# Altium project EVK-NORA-B10x.PrjPcb (part 1 of 3)
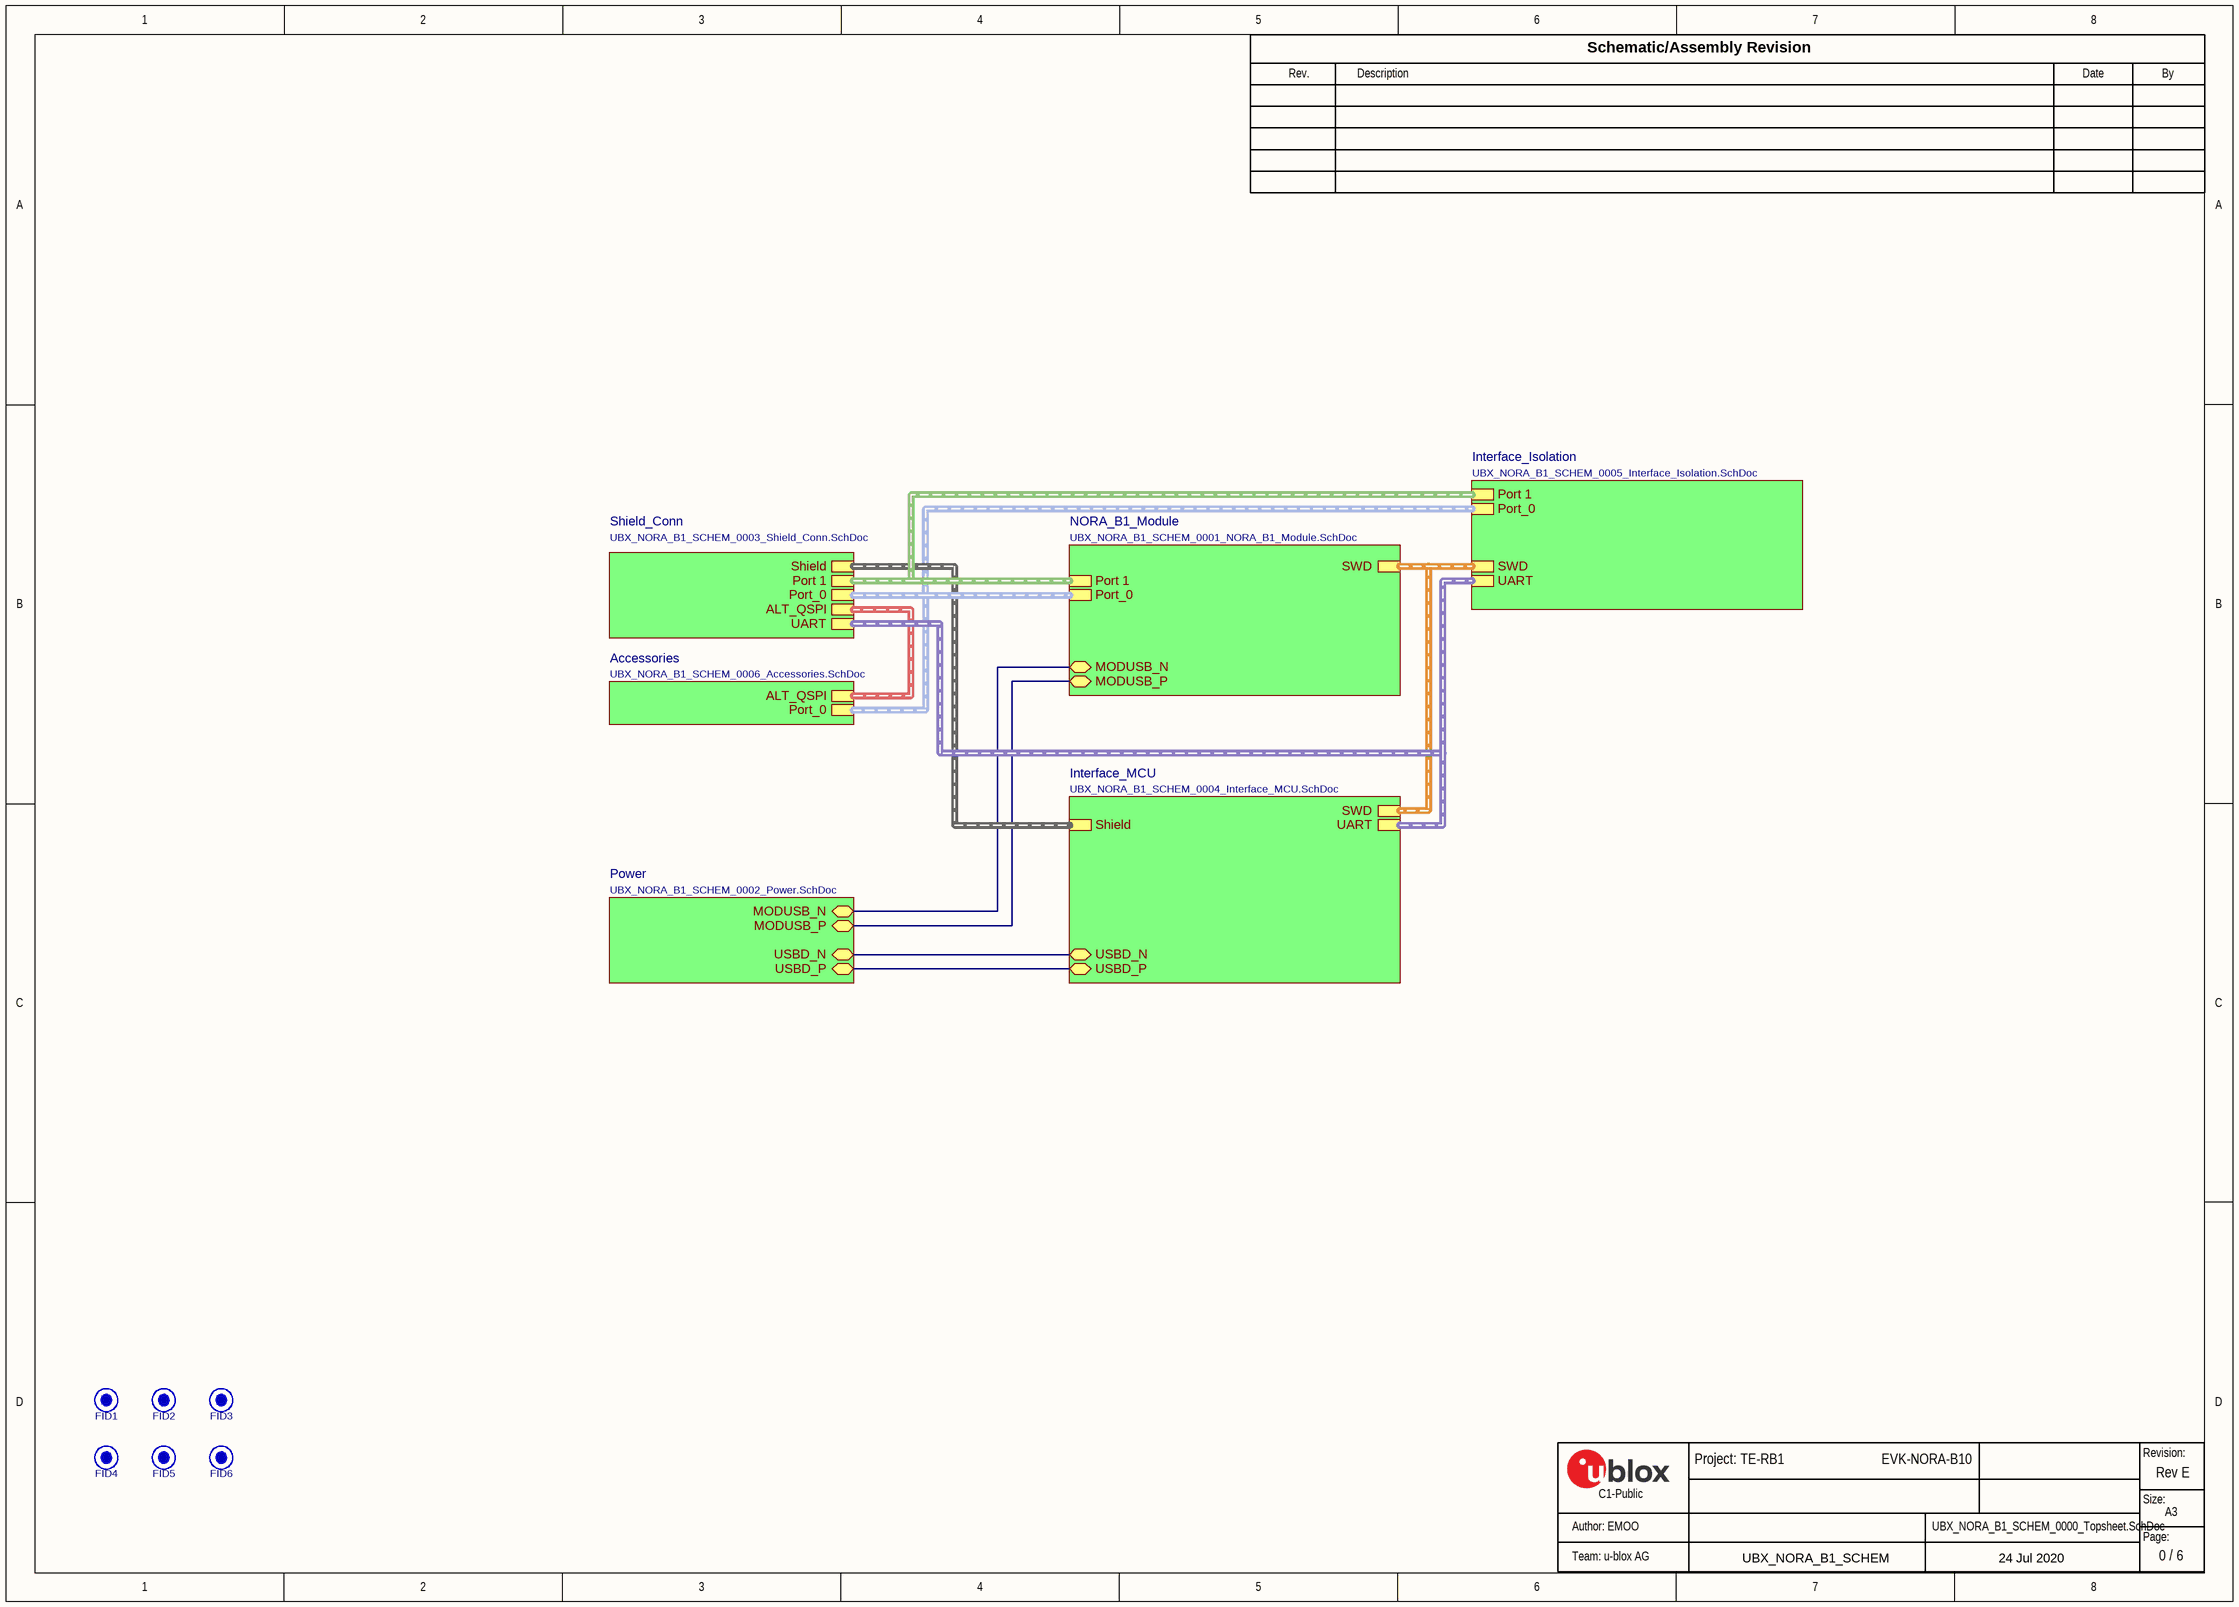
[diagram p0: UBX_NORA_B1_SCHEM_0000_Topsheet.SchDoc]
GlobalClientName: u-blox; GlobalProjectCode: EVK-NORA-B10; GlobalProjectLink: www.u-blox.com; GlobalProjectName: TE-RB1; GlobalProjectRevision: Rev E; GlobalProjectTeam: u-blox AG; GlobalReleaseDate: 4/28/2021; PCBDocNum: UBXH60-0000702; PCBName: EVK-NORA-B10; ProjectEngineer: EMOO; ReleaseBy1: EMOO; ReleaseBy2: EMOO; ReleaseBy3: EMOO; ReleaseBy4: EMOO; ReleaseBy5: EMOO; ReleaseDate1: 7/20/2020; ReleaseDate2: 9/16/2020; ReleaseDate3: 11/16/2020; ReleaseDate4: 3/16/2021; ReleaseDate5: 4/28/2021; ReleaseDesc1: Initial Prototype Release; ReleaseDesc2: Second Prototype Release; ReleaseDesc3: Engineering Sample Release; ReleaseDesc4: Initial Production Release; ReleaseDesc5: Addition of BGA-121 Interface IC; ReleaseRev1: Rev A; ReleaseRev2: Rev B; ReleaseRev3: Rev C; ReleaseRev4: Rev D; ReleaseRev5: Rev E; SchConfidentialGrade: C1-Public; SchDocNum: UBX_NORA_B1_SCHEM; SchSheetTotal: 6; VariantRev: Rev E
7 sheets, 362 parts. Net scope: flat (ports and power ports of the same name join across sheets).
Board file: NORA-B1-EVK.PcbDoc
Sheets:
  UBX_NORA_B1_SCHEM_0000_Topsheet.SchDoc
    NORA_B1_Module = UBX_NORA_B1_SCHEM_0001_NORA_B1_Module.SchDoc
    Interface_MCU = UBX_NORA_B1_SCHEM_0004_Interface_MCU.SchDoc
    Shield_Conn = UBX_NORA_B1_SCHEM_0003_Shield_Conn.SchDoc
    Interface_Isolation = UBX_NORA_B1_SCHEM_0005_Interface_Isolation.SchDoc
    Accessories = UBX_NORA_B1_SCHEM_0006_Accessories.SchDoc
    Power = UBX_NORA_B1_SCHEM_0002_Power.SchDoc

## Sheet UBX_NORA_B1_SCHEM_0000_Topsheet.SchDoc
size A3; Date: 7/24/2020; CompanyName: U-Blox; DrawnBy: EMOO; Engineer: EMOO; Organization: U-Blox; Address1: 3950 Fairview Industrial Dr SE #100; Address2: Salem, OR 97302; SheetNumber: 0; SheetTotal: 6; SheetSize: B; SheetTitle: TopSheet

### Parts
FID1  FID  [FIDUCIAL40]  (value not drawn)
FID2  FID  [FIDUCIAL40]  (value not drawn)
FID3  FID  [FIDUCIAL40]  (value not drawn)
FID4  FID  [FIDUCIAL40]  (value not drawn)
FID5  FID  [FIDUCIAL40]  (value not drawn)
FID6  FID  [FIDUCIAL40]  (value not drawn)

### Sub-sheets
Accessories = UBX_NORA_B1_SCHEM_0006_Accessories.SchDoc: Port_0 (harness Port 0), ALT_QSPI (harness ALT_QSPI)
Interface_Isolation = UBX_NORA_B1_SCHEM_0005_Interface_Isolation.SchDoc: Port_0 (harness Port 0), SWD (harness SWD), UART (harness UART), Port 1 (harness Port 1)
Interface_MCU = UBX_NORA_B1_SCHEM_0004_Interface_MCU.SchDoc: SWD (harness SWD), USBD_N (bidir), USBD_P (bidir), UART (harness UART), Shield (harness Shield)
NORA_B1_Module = UBX_NORA_B1_SCHEM_0001_NORA_B1_Module.SchDoc: Port_0 (harness Port 0), Port 1 (harness Port 1), SWD (harness SWD), MODUSB_N (bidir), MODUSB_P (bidir)
Power = UBX_NORA_B1_SCHEM_0002_Power.SchDoc: USBD_N (bidir), MODUSB_P (bidir), MODUSB_N (bidir), USBD_P (bidir)
Shield_Conn = UBX_NORA_B1_SCHEM_0003_Shield_Conn.SchDoc: Port 1 (harness Port 1), Port_0 (harness Port 0), Shield (harness Shield), UART (harness UART), ALT_QSPI (harness ALT_QSPI)

### Nets
(unnamed): sheet NORA_B1_Module/MODUSB_N, sheet Power/MODUSB_N
(unnamed): sheet NORA_B1_Module/MODUSB_P, sheet Power/MODUSB_P
(unnamed): sheet Interface_MCU/USBD_N, sheet Power/USBD_N
(unnamed): sheet Interface_MCU/USBD_P, sheet Power/USBD_P

### Buses and harness runs
harness sheet Accessories/ALT_QSPI = sheet Shield_Conn/ALT_QSPI
harness sheet Accessories/Port_0 = sheet Interface_Isolation/Port_0 = sheet NORA_B1_Module/Port_0 = sheet Shield_Conn/Port_0
harness sheet Interface_Isolation/Port 1 = sheet NORA_B1_Module/Port 1 = sheet Shield_Conn/Port 1
harness sheet Interface_Isolation/SWD = sheet Interface_MCU/SWD = sheet NORA_B1_Module/SWD
harness sheet Interface_Isolation/UART = sheet Interface_MCU/UART = sheet Shield_Conn/UART
harness sheet Interface_MCU/Shield = sheet Shield_Conn/Shield

### Notes on the sheet
- 24 Jul 2020
- Rev.
- Description
- Schematic/Assembly Revision
- Date
- By
- Revision:
- Page:
- Size:
- A3

### Library data of the parts
FID1-FID6 = UBXH00-0000100: FIDUCIAL MARK 1MM DIA; Editor: eric.moog; Env: ROHS; Permitted Use: Volume Products; Perferred: PREF; Part Number: UBXH00-0000100; Min Operating Temp: -55°C; Max Operating Temp: 155°C; Part Type: Testpoint; UBX Wiki: https://wiki.u-blox.com/bin/view/Operations/PartDetails?index=38802; RefDes: TP

## Sheet UBX_NORA_B1_SCHEM_0001_NORA_B1_Module.SchDoc: UBX_NORA_B1_SCHEM_0001_NORA_B1_Module
size A3; Date: 7/24/2020; CompanyName: U-blox; DrawnBy: EMOO; Engineer: EMOO; Organization: U-blox; Address1: 3950 Fairview Industrial Dr SE #100; Address2: Salem, OR 97302; SheetNumber: 1; SheetTotal: 6; Website: www.u-blox.com; SheetSize: B; SheetTitle: NORA_B1
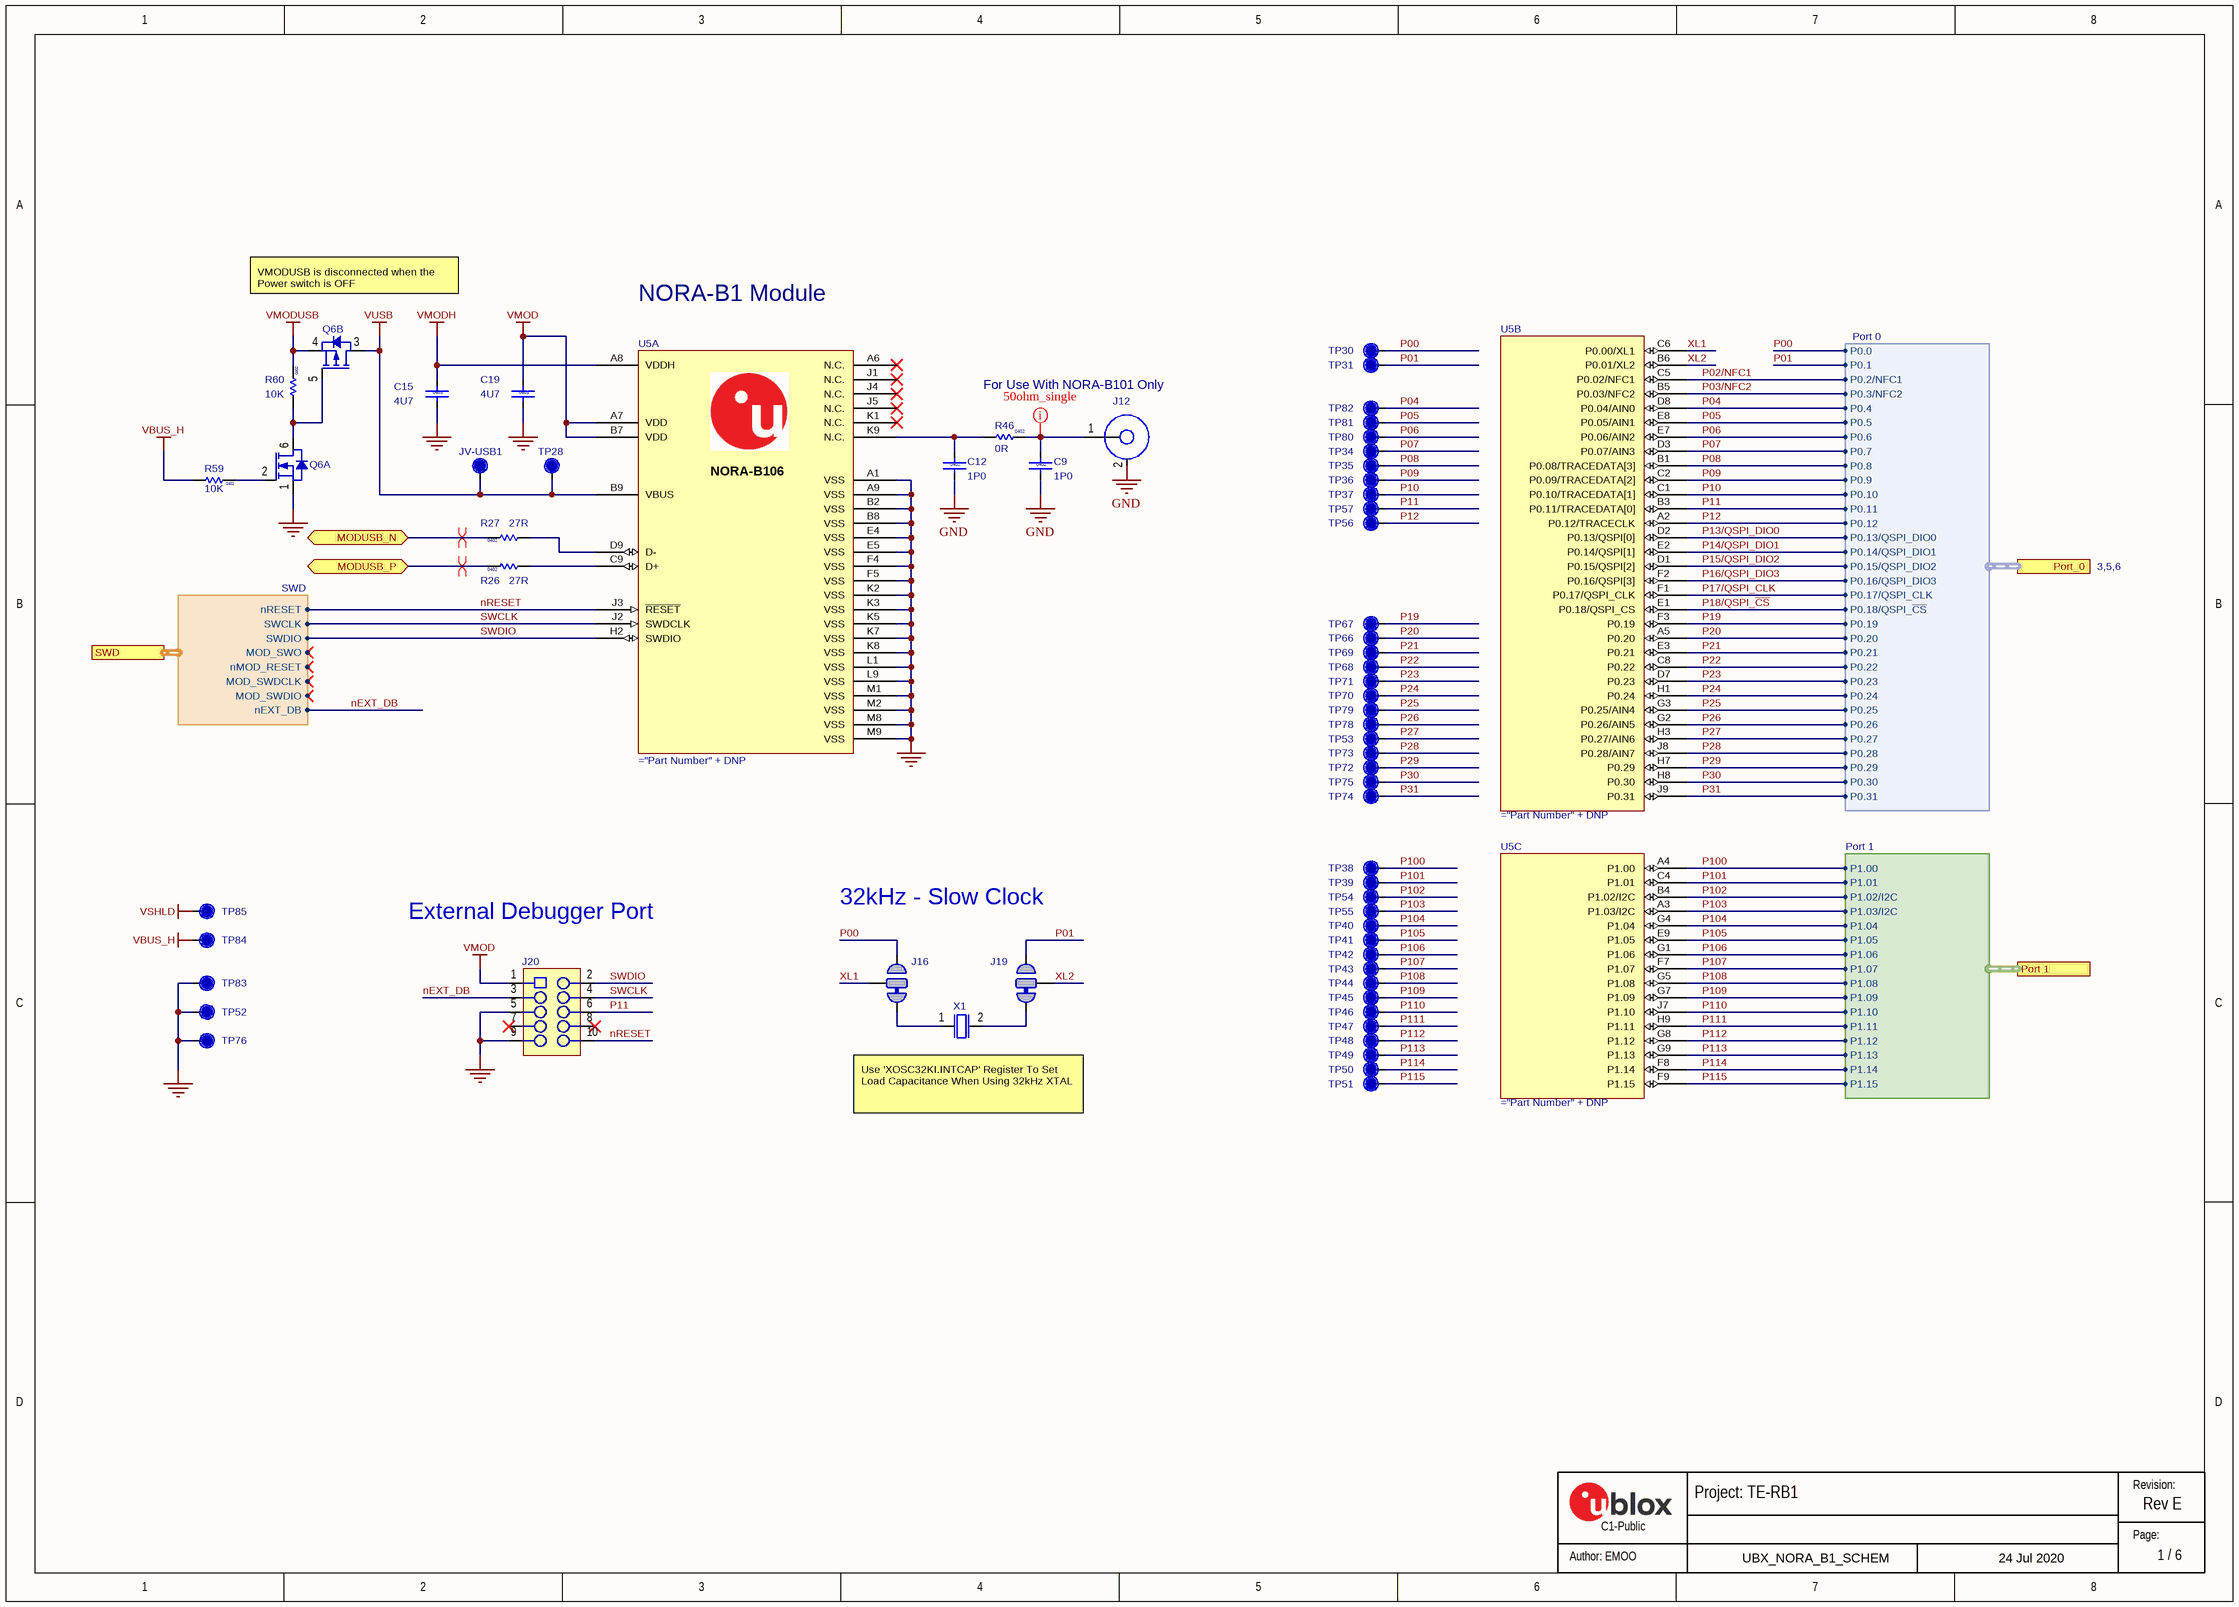
[diagram p1: UBX_NORA_B1_SCHEM_0001_NORA_B1_Module.SchDoc]

### Parts
C9  value 1P0  Size: 0402  [Cap 0402 HD]
C12  value 1P0  Size: 0402  [Cap 0402 HD]
C15  value 4U7  Size: 0603  [CAP 0603 HD]
C19  value 4U7  Size: 0603  [CAP 0603 HD]
J12  (no value)  [U.FL_3Pin]
J16  (no value)  [Solderbridge-Option]  (net tie, no BOM)
J19  (no value)  [Solderbridge-Option]  (net tie, no BOM)
J20  (no value)  [FTSH-105-01-F-DV-K]
JV-USB1  TP  [TP10R_NO_SILK]  (value not drawn)  (no BOM)
Q6  (no value)  [SOT-563]  (parts A,B of 2)
R26  value 27R  Size: 0402  [RES 0402 HD]
R27  value 27R  Size: 0402  [RES 0402 HD]
R46  value 0R  Size: 0402  [RES 0402 HD]
R59  value 10K  Size: 0402  [RES 0402 HD]
R60  value 10K  Size: 0402  [RES 0402 HD]
TP28  TP  [TP10R_NO_SILK]  (value not drawn)  (no BOM)
TP30  TP  [TP10R_NO_SILK]  (value not drawn)  (no BOM)
TP31  TP  [TP10R_NO_SILK]  (value not drawn)  (no BOM)
TP34  TP  [TP10R_NO_SILK]  (value not drawn)  (no BOM)
TP35  TP  [TP10R_NO_SILK]  (value not drawn)  (no BOM)
TP36  TP  [TP10R_NO_SILK]  (value not drawn)  (no BOM)
TP37  TP  [TP10R_NO_SILK]  (value not drawn)  (no BOM)
TP38  TP  [TP10R_NO_SILK]  (value not drawn)
TP39  TP  [TP10R_NO_SILK]  (value not drawn)
TP40  TP  [TP10R_NO_SILK]  (value not drawn)
TP41  TP  [TP10R_NO_SILK]  (value not drawn)
TP42  TP  [TP10R_NO_SILK]  (value not drawn)
TP43  TP  [TP10R_NO_SILK]  (value not drawn)
TP44  TP  [TP10R_NO_SILK]  (value not drawn)
TP45  TP  [TP10R_NO_SILK]  (value not drawn)
TP46  TP  [TP10R_NO_SILK]  (value not drawn)
TP47  TP  [TP10R_NO_SILK]  (value not drawn)
TP48  TP  [TP10R_NO_SILK]  (value not drawn)
TP49  TP  [TP10R_NO_SILK]  (value not drawn)
TP50  TP  [TP10R_NO_SILK]  (value not drawn)
TP51  TP  [TP10R_NO_SILK]  (value not drawn)
TP52  TP  [TP10R_NO_SILK]  (value not drawn)  (no BOM)
TP53  TP  [TP10R_NO_SILK]  (value not drawn)
TP54  TP  [TP10R_NO_SILK]  (value not drawn)
TP55  TP  [TP10R_NO_SILK]  (value not drawn)
TP56  TP  [TP10R_NO_SILK]  (value not drawn)  (no BOM)
TP57  TP  [TP10R_NO_SILK]  (value not drawn)  (no BOM)
TP66  TP  [TP10R_NO_SILK]  (value not drawn)
TP67  TP  [TP10R_NO_SILK]  (value not drawn)
TP68  TP  [TP10R_NO_SILK]  (value not drawn)
TP69  TP  [TP10R_NO_SILK]  (value not drawn)
TP70  TP  [TP10R_NO_SILK]  (value not drawn)
TP71  TP  [TP10R_NO_SILK]  (value not drawn)
TP72  TP  [TP10R_NO_SILK]  (value not drawn)
TP73  TP  [TP10R_NO_SILK]  (value not drawn)
TP74  TP  [TP10R_NO_SILK]  (value not drawn)
TP75  TP  [TP10R_NO_SILK]  (value not drawn)
TP76  TP  [TP10R_NO_SILK]  (value not drawn)  (no BOM)
TP78  TP  [TP10R_NO_SILK]  (value not drawn)
TP79  TP  [TP10R_NO_SILK]  (value not drawn)
TP80  TP  [TP10R_NO_SILK]  (value not drawn)  (no BOM)
TP81  TP  [TP10R_NO_SILK]  (value not drawn)  (no BOM)
TP82  TP  [TP10R_NO_SILK]  (value not drawn)  (no BOM)
TP83  TP  [TP10R_NO_SILK]  (value not drawn)  (no BOM)
TP84  TP  [TP10R_NO_SILK]  (value not drawn)  (no BOM)
TP85  TP  [TP10R_NO_SILK]  (value not drawn)  (no BOM)
U5  (no value)  [NORA-B106]  (parts A,B,C of 3)
X1  (no value)  [XTAL_3215]

### Ports
MODUSB_N (bidir), MODUSB_P (bidir), Port 1 (harness Port 1), Port_0 (harness Port 0), SWD (harness SWD)

### Harnesses
Port 0: P0.4, P0.5, P0.6, P0.7, P0.8, P0.9, P0.10, P0.11, P0.12, P0.19, P0.20, P0.21, P0.22, P0.23, P0.24, P0.25, P0.26, P0.27, P0.28, P0.29, P0.30, P0.31, P0.3/NFC2, P0.2/NFC1, P0.13/QSPI_DIO0, P0.14/QSPI_DIO1, P0.15/QSPI_DIO2, P0.16/QSPI_DIO3, P0.18/QSPI_~{CS}, P0.17/QSPI_CLK, P0.0, P0.1
Port 1: P1.00, P1.01, P1.02/I2C, P1.03/I2C, P1.04, P1.05, P1.06, P1.07, P1.08, P1.09, P1.10, P1.11, P1.12, P1.13, P1.14, P1.15
SWD: MOD_SWDIO, MOD_SWDCLK, SWCLK, SWDIO, nMOD_RESET, MOD_SWO, nRESET, nEXT_DB

### Nets
GND: C9.2 C12.2 C15.2 C19.2 J12.2 J20.5 J20.9 Q6.1(S1) TP52.1 TP76.1 TP83.1 U5.A1(VSS) U5.A9(VSS) U5.B2(VSS) U5.B8(VSS) U5.E4(VSS) U5.E5(VSS) U5.F4(VSS) U5.F5(VSS) U5.K2(VSS) U5.K3(VSS) U5.K5(VSS) U5.K7(VSS) U5.K8(VSS) U5.L1(VSS) U5.L9(VSS) U5.M1(VSS) U5.M2(VSS) U5.M8(VSS) U5.M9(VSS)
VBUS_H: R59.1 TP84.1
VMOD: C19.1 J20.1 U5.A7(VDD) U5.B7(VDD)
VMODH: C15.1 U5.A8(VDDH)
VMODUSB: Q6.4(S2) R60.2
VSHLD: TP85.1
VUSB: JV-USB1.1 Q6.3(D2) TP28.1 U5.B9(VBUS)
MODUSBD_N: R27.2 ; port MODUSB_N
MODUSBD_P: R26.2 ; port MODUSB_P
nEXT_DB: J20.3 ; port SWD.nEXT_DB
nRESET: J20.10 U5.J3(~{RESET}) ; port SWD.nRESET
P00: J16.3 TP30.1 ; port Port_0.P0.0
P01: J19.3 TP31.1 ; port Port_0.P0.1
P02/NFC1: U5.C5(P0.02/NFC1) ; port Port_0.P0.2/NFC1  [project net P0.2/NFC1]
P03/NFC2: U5.B5(P0.03/NFC2) ; port Port_0.P0.3/NFC2  [project net P0.3/NFC2]
P04: TP82.1 U5.D8(P0.04/AIN0) ; port Port_0.P0.4
P05: TP81.1 U5.E8(P0.05/AIN1) ; port Port_0.P0.5
P06: TP80.1 U5.E7(P0.06/AIN2) ; port Port_0.P0.6
P07: TP34.1 U5.D3(P0.07/AIN3) ; port Port_0.P0.7
P08: TP35.1 U5.B1(P0.08/TRACEDATA[3]) ; port Port_0.P0.8
P09: TP36.1 U5.C2(P0.09/TRACEDATA[2]) ; port Port_0.P0.9
P10: TP37.1 U5.C1(P0.10/TRACEDATA[1]) ; port Port_0.P0.10
P11: J20.6 TP57.1 U5.B3(P0.11/TRACEDATA[0]) ; port Port_0.P0.11  [project net P0.11]
P12: TP56.1 U5.A2(P0.12/TRACECLK) ; port Port_0.P0.12
P13/QSPI_DIO0: U5.D2(P0.13/QSPI[0]) ; port Port_0.P0.13/QSPI_DIO0
P14/QSPI_DIO1: U5.E2(P0.14/QSPI[1]) ; port Port_0.P0.14/QSPI_DIO1
P15/QSPI_DIO2: U5.D1(P0.15/QSPI[2]) ; port Port_0.P0.15/QSPI_DIO2
P16/QSPI_DIO3: U5.F2(P0.16/QSPI[3]) ; port Port_0.P0.16/QSPI_DIO3
P17/QSPI_CLK: U5.F1(P0.17/QSPI_CLK) ; port Port_0.P0.17/QSPI_CLK
P18/QSPI_~{CS}: U5.E1(P0.18/QSPI_CS) ; port Port_0.P0.18/QSPI_~{CS}
P19: TP67.1 U5.F3(P0.19) ; port Port_0.P0.19
P20: TP66.1 U5.A5(P0.20) ; port Port_0.P0.20
P21: TP69.1 U5.E3(P0.21) ; port Port_0.P0.21
P22: TP68.1 U5.C8(P0.22) ; port Port_0.P0.22
P23: TP71.1 U5.D7(P0.23) ; port Port_0.P0.23
P24: TP70.1 U5.H1(P0.24) ; port Port_0.P0.24
P25: TP79.1 U5.G3(P0.25/AIN4) ; port Port_0.P0.25
P26: TP78.1 U5.G2(P0.26/AIN5) ; port Port_0.P0.26
P27: TP53.1 U5.H3(P0.27/AIN6) ; port Port_0.P0.27
P28: TP73.1 U5.J8(P0.28/AIN7) ; port Port_0.P0.28
P29: TP72.1 U5.H7(P0.29) ; port Port_0.P0.29
P30: TP75.1 U5.H8(P0.30) ; port Port_0.P0.30
P31: TP74.1 U5.J9(P0.31) ; port Port_0.P0.31
P100: TP38.1 U5.A4(P1.00) ; port Port 1.P1.00
P101: TP39.1 U5.C4(P1.01) ; port Port 1.P1.01
P102: TP54.1 U5.B4(P1.02/I2C) ; port Port 1.P1.02/I2C
P103: TP55.1 U5.A3(P1.03/I2C) ; port Port 1.P1.03/I2C
P104: TP40.1 U5.G4(P1.04) ; port Port 1.P1.04
P105: TP41.1 U5.E9(P1.05) ; port Port 1.P1.05
P106: TP42.1 U5.G1(P1.06) ; port Port 1.P1.06
P107: TP43.1 U5.F7(P1.07) ; port Port 1.P1.07
P108: TP44.1 U5.G5(P1.08) ; port Port 1.P1.08
P109: TP45.1 U5.G7(P1.09) ; port Port 1.P1.09
P110: TP46.1 U5.J7(P1.10) ; port Port 1.P1.10
P111: TP47.1 U5.H9(P1.11) ; port Port 1.P1.11
P112: TP48.1 U5.G8(P1.12) ; port Port 1.P1.12
P113: TP49.1 U5.G9(P1.13) ; port Port 1.P1.13
P114: TP50.1 U5.F8(P1.14) ; port Port 1.P1.14
P115: TP51.1 U5.F9(P1.15) ; port Port 1.P1.15
SWCLK: J20.4 U5.J2(SWDCLK) ; port SWD.SWCLK
SWDIO: J20.2 U5.H2(SWDIO) ; port SWD.SWDIO
XL1: J16.2 U5.C6(P0.00/XL1)
XL2: J19.2 U5.B6(P0.01/XL2)
NetC9_1: C9.1 J12.1(ANT) R46.2
NetC12_1: C12.1 R46.1 U5.K9(N.C.)
NetJ16_1: J16.1 X1.1
NetJ19_1: J19.1 X1.2
NetQ6_2: Q6.2(G1) R59.2
NetQ6_5: Q6.5(G2) Q6.6(D1) R60.1
NetR26_1: R26.1 U5.C9(D+)
NetR27_1: R27.1 U5.D9(D-)

Not connected (* = marked no-connect by the designer): J20 7* 8*; U5 A6(N.C.)* J1(N.C.)* J4(N.C.)* J5(N.C.)* K1(N.C.)*

### Layout directives
differential pair; net class USB_DIFF: MODUSBD_N, MODUSBD_P
net class 50_ohm_se: NetC9_1

### Notes on the sheet
- VMODUSB is disconnected when the Power switch is OFF
- NORA-B1 Module
- For Use With NORA-B101 Only
- 32kHz - Slow Clock
- External Debugger Port
- (near X1) Use 'XOSC32KI.INTCAP' Register To Set Load Capacitance When Using 32kHz XTAL
- 24 Jul 2020
- Revision:
- Page:

### Library data of the parts
C9 C12 = UBXH01-0009002: CAP CER C0G 0402 1P0 +/-0.1P 50V; Manufacturer: Murata Manufacturing Company, Ltd.; Manufacturer P/N: GRM1555C1H1R0BA01; Editor: massimo.vlacci; Released by: sandro.sestan; Env: ROHS; Permitted Use: Volume Products; Perferred: PREF; Mfg P/N Status: NRND; Mfg P/N Split: 100; Mfg P/N Released: Yes; Part Number: UBXH01-0009002; Tolerance: +/-0.1P; Max Voltage: 50V; Min Operating Temp: -55°C; Max Operating Temp: 125°C; Part Type: Capacitor; Release Data: 2010-02-19T10:36:53; UBX Wiki: https://wiki.u-blox.com/bin/view/Operations/PartDetails?index=5431; RefDes: C; Manufacturer 2: Murata Manufacturing Company, Ltd.; Manufacturer P/N 2: GRM1555C1H1R0BZ01; Mfg P/N Status 2: Obsolete; Mfg P/N Split 2: 0; Mfg P/N Released 2: No
C15 C19 = UBXH01-2002003: CAP CER X5R 0603 4U7 10% 6.3V; Manufacturer: Murata Manufacturing Company, Ltd.; Manufacturer P/N: GRM188R61C475KE11; Editor: philippe.largier; Released by: roland.rust; Env: GREEN; Permitted Use: Volume Products; Perferred: PREF; Mfg P/N Status: Active; Mfg P/N Split: 100; Mfg P/N Released: Yes; Part Number: UBXH01-2002003; Tolerance: 10%; Max Voltage: 6.3V; Part Type: Capacitor; Release Data: 2016-02-02T16:39:45; UBX Wiki: https://wiki.u-blox.com/bin/view/Operations/PartDetails?index=5742; RefDes: C; Mfg P/N Datasheet: https://wiki.u-blox.com/bin/view/Generic/Docs/DocumentSummary?index=30154; Manufacturer 2: Murata Manufacturing Company, Ltd.; Manufacturer P/N 2: GRM188R61E475KE11; Mfg P/N Status 2: Active; Mfg P/N Split 2: 0; Mfg P/N Released 2: Yes; Mfg P/N Datasheet 2: https://wiki.u-blox.com/bin/view/Generic/Docs/DocumentSummary?index=30500; Manufacturer 3: Samsung Electro-Mechanics; Manufacturer P/N 3: CL10A475KO8NNN; Mfg P/N Status 3: NRND; Mfg P/N Split 3: 0; Mfg P/N Released 3: Yes; Mfg P/N Datasheet 3: https://wiki.u-blox.com/bin/view/Generic/Docs/DocumentSummary?index=28177
J12 = UBXH04-0000657: CONN U.FL STRAIGHT RECEPTACLE; Manufacturer P/N: U.FL-R-SMT-1(80); Manufacturer: Hirose; Value: U.FL-R-SMT-1(80); Editor: cam.nichols; Released by: eric.moog; Env: GREEN; Permitted Use: Volume Products; Perferred: PREF; Mfg P/N Status: Active; Mfg P/N Split: 100; Mfg P/N Released: No; Part Number: UBXH04-0000657; Min Operating Temp: -40°C; Max Operating Temp: 105°C; Part Type: Connector; Release Data: 2020-09-04T22:33:09; UBX Wiki: https://wiki.u-blox.com/bin/view/Operations/PartDetails?index=33335; RefDes: J; Mfg P/N Datasheet: https://wiki.u-blox.com/bin/view/Generic/Docs/DocumentSummary?index=32065; Manufacturer 2: Toptek; Manufacturer P/N 2: AB02001-126; Mfg P/N Status 2: Active; Mfg P/N Split 2: 0; Mfg P/N Released 2: No; Mfg P/N Datasheet 2: https://wiki.u-blox.com/bin/view/Generic/Docs/DocumentSummary?index=33337
J16 J19 = UBXH00-0000083: SOLDERBRIDGE-OPTION; Editor: aneeb.sohail; Env: GREEN; Permitted Use: Volume Products; Perferred: PREF; Part Number: UBXH00-0000083; Min Operating Temp: -55°C; Max Operating Temp: 155°C; Part Type: Connector; UBX Wiki: https://wiki.u-blox.com/bin/view/Operations/PartDetails?index=36362; RefDes: J
J20 = UBXH04-0000194: 2-ROW SMD-PCB CONN 50MIL GRID 10 -PIN 0.41MM SQUARE 4.0MM KEYED; Manufacturer P/N: FTSH-105-01-L-DV-K; Manufacturer: Samtec; Value: FTSH-105-01-L-DV-K; Editor: par.hakansson; Released by: adam.johansson; Env: ROHS; Permitted Use: Volume Products; Perferred: PREF; Mfg P/N Status: Active; Mfg P/N Split: 100; Mfg P/N Released: Yes; Part Number: UBXH04-0000194; Min Operating Temp: -40°C; Max Operating Temp: 85°C; Part Type: Connector; Release Data: 2015-11-06T11:35:39; UBX Wiki: https://wiki.u-blox.com/bin/view/Operations/PartDetails?index=20823; RefDes: J; Mfg P/N Datasheet: https://wiki.u-blox.com/bin/view/Generic/Docs/DocumentSummary?index=20824
JV-USB1 TP28 TP30 TP31 TP34-TP57 TP66-TP76 TP78-TP85 = UBXH00-0000096: TESTPOINT 1MM CIRCULAR NO SILKSCREEN; Editor: eric.moog; Permitted Use: Volume Products; Perferred: PREF; Part Number: UBXH00-0000096; Min Operating Temp: -55°C; Max Operating Temp: 125°C; Part Type: Testpoint; UBX Wiki: https://wiki.u-blox.com/bin/view/Operations/PartDetails?index=38784; Env: N/A; RefDes: TP
Q6 = UBXH20-0000084: SMALL SIGNAL COMPLEMENTARY W/ ESD PROTECTION MOSFET SOT-563-6 PACKAGE; Manufacturer: ON Semiconductor; Value: NTZD3155CT1G; Editor: pierpaolo.arban; Released by: matej.budin; Env: ROHS; Permitted Use: Support Products; Perferred: PREF; Mfg P/N Status: Active; Mfg P/N Split: 100; Mfg P/N Released: Yes; Part Number: UBXH20-0000084; Min Operating Temp: -55°C; Max Operating Temp: 155°C; Part Type: Transistor; Release Data: 2023-01-26T11:59:16; UBX Wiki: https://wiki.u-blox.com/bin/view/Operations/PartDetails?index=37717; RefDes: Q; Manufacturer P/N: NTZD3155CT1G; Mfg P/N Datasheet: https://wiki.u-blox.com/bin/view/Generic/Docs/DocumentSummary?index=9037
R26 R27 = UBXH18-0008011: RES THICK FILM CHIP 0402 27R 5% 100mW; Manufacturer: KOA; Manufacturer P/N: RK73B1ETTD270J; Editor: roland.rust; Env: ROHS; Permitted Use: Volume Products; Perferred: PREF; Mfg P/N Status: NRND; Mfg P/N Split: 100; Mfg P/N Released: Yes; Part Number: UBXH18-0008011; Tolerance: 5%; Max Power: 100mW; Part Type: Resistor; Released by: roland.rust; Release Data: 2005-07-22T13:59:44; UBX Wiki: https://wiki.u-blox.com/bin/view/Operations/PartDetails?index=6883; RefDes: R; Manufacturer 2: YAGEO; Manufacturer P/N 2: 2322_705_70279_L; Mfg P/N Status 2: Obsolete; Mfg P/N Split 2: 0; Mfg P/N Released 2: Yes
R46 = UBXH18-0003002: RES THICK FILM CHIP 0402 0R 0 100mW; Manufacturer: KOA; Manufacturer P/N: RK73Z1ETTD; Tolerance: 0; Editor: charlotte.biber; Released by: peter.mueller; Env: ROHS; Permitted Use: Volume Products; Perferred: PREF; Mfg P/N Status: NRND; Mfg P/N Split: 100; Mfg P/N Released: Yes; Part Number: UBXH18-0003002; Max Power: 100mW; Part Type: Resistor; Release Data: 2012-06-05T09:49:55; UBX Wiki: https://wiki.u-blox.com/bin/view/Operations/PartDetails?index=6611; RefDes: R; Manufacturer 2: YAGEO; Manufacturer P/N 2: 2322_705_91001_L; Mfg P/N Status 2: NRND; Mfg P/N Split 2: 0; Mfg P/N Released 2: Yes
R59 R60 = UBXH18-0000065: RES THICK FILM CHIP 0402 10K 1% 63mW; Manufacturer: KOA; Manufacturer P/N: RK73H1ETTP1002F; Editor: erian.bezhani; Released by: massimo.vlacci; Env: ROHS; Permitted Use: Volume Products; Perferred: PREF; Mfg P/N Status: Active; Mfg P/N Split: 100; Mfg P/N Released: Yes; Part Number: UBXH18-0000065; Tolerance: 1%; Max Power: 63mW; Part Type: Resistor; Release Data: 2012-06-08T18:02:21; UBX Wiki: https://wiki.u-blox.com/bin/view/Operations/PartDetails?index=16837; RefDes: R; Mfg P/N Datasheet: https://wiki.u-blox.com/bin/view/Generic/Docs/DocumentSummary?index=8222
U5 = UBXH14-0000700: SHORT RANGE BLE AND 802.15.4 MODULE U-BLOX NORA-B106 5.5V 10mA; Manufacturer P/N: NORA-B106-00B-00; Manufacturer Part Number 1: NORA-B106-00B; Body Size: 14.3mm x 10.4mm; Component Mounting Type: SMT; Core Architecture: Dual Cortex-M33; Flash Size: 1MB; Internal Antenna: Yes; Max Oper Temp in C: +105; MFG Package: NORA-82; Min Oper Temp in C: -40; RF Frequency: 2.4GHZ; SMT Pitch: 1.1mm; Value: NORA-B106-00B-00; Editor: eric.moog; Env: ROHS; Permitted Use: Support Products; Perferred: PREF; Mfg P/N Status: Active; Mfg P/N Split: 100; Mfg P/N Released: No; ComponentLink1URL: *; ComponentLink1Description: Datasheet; ComponentLink2URL: *; ComponentLink2Description: Supplier link; Part Number: UBXH14-0000700; Part Name: NORA-B106; Part_Type: Module; Manufacturer: u-blox; Height: 1.8mm; Package Type: LGA; Pins: 82; Use in new designs: Yes; Voltage: 5.5V; Manufacturer 1: u-blox; Max Voltage: 5.5V; Max Current: 10mA; Min Operating Temp: -40°C; Max Operating Temp: 105°C; Part Type: RF; UBX Wiki: https://wiki.u-blox.com/bin/view/Operations/PartDetails?index=38882; RefDes: A; Mfg P/N Datasheet: https://wiki.u-blox.com/bin/view/Generic/Docs/DocumentSummary?index=38876
X1 = UBXH21-0000123: CRYSTAL CL=6PF 3.2 X 1.5 MM 32.768KHZ 20PPM; Manufacturer P/N: ABS07-120-32.768KHZ-T; Manufacturer: ABRACON; Editor: martin.grasse; Env: ROHS; Permitted Use: Support Products; Perferred: PREF; Mfg P/N Status: NRND; Mfg P/N Split: 100; Mfg P/N Released: No; Part Number: UBXH21-0000123; Value: 32.768KHZ; Tolerance: 20PPM; Part Type: Crystal; UBX Wiki: https://wiki.u-blox.com/bin/view/Operations/PartDetails?index=27619; RefDes: Y; Mfg P/N Datasheet: https://wiki.u-blox.com/bin/view/Generic/Docs/DocumentSummary?index=27621

## Sheet UBX_NORA_B1_SCHEM_0004_Interface_MCU.SchDoc
size A3; Date: 7/24/2020; CompanyName: U-blox; DrawnBy: EMOO; Engineer: EMOO; Organization: U-blox; Address1: 3950 Fairview Industrial Dr SE #100; Address2: Salem, OR 97302; SheetNumber: 4; SheetTotal: 6; SheetSize: B; SheetTitle: Interface MCU
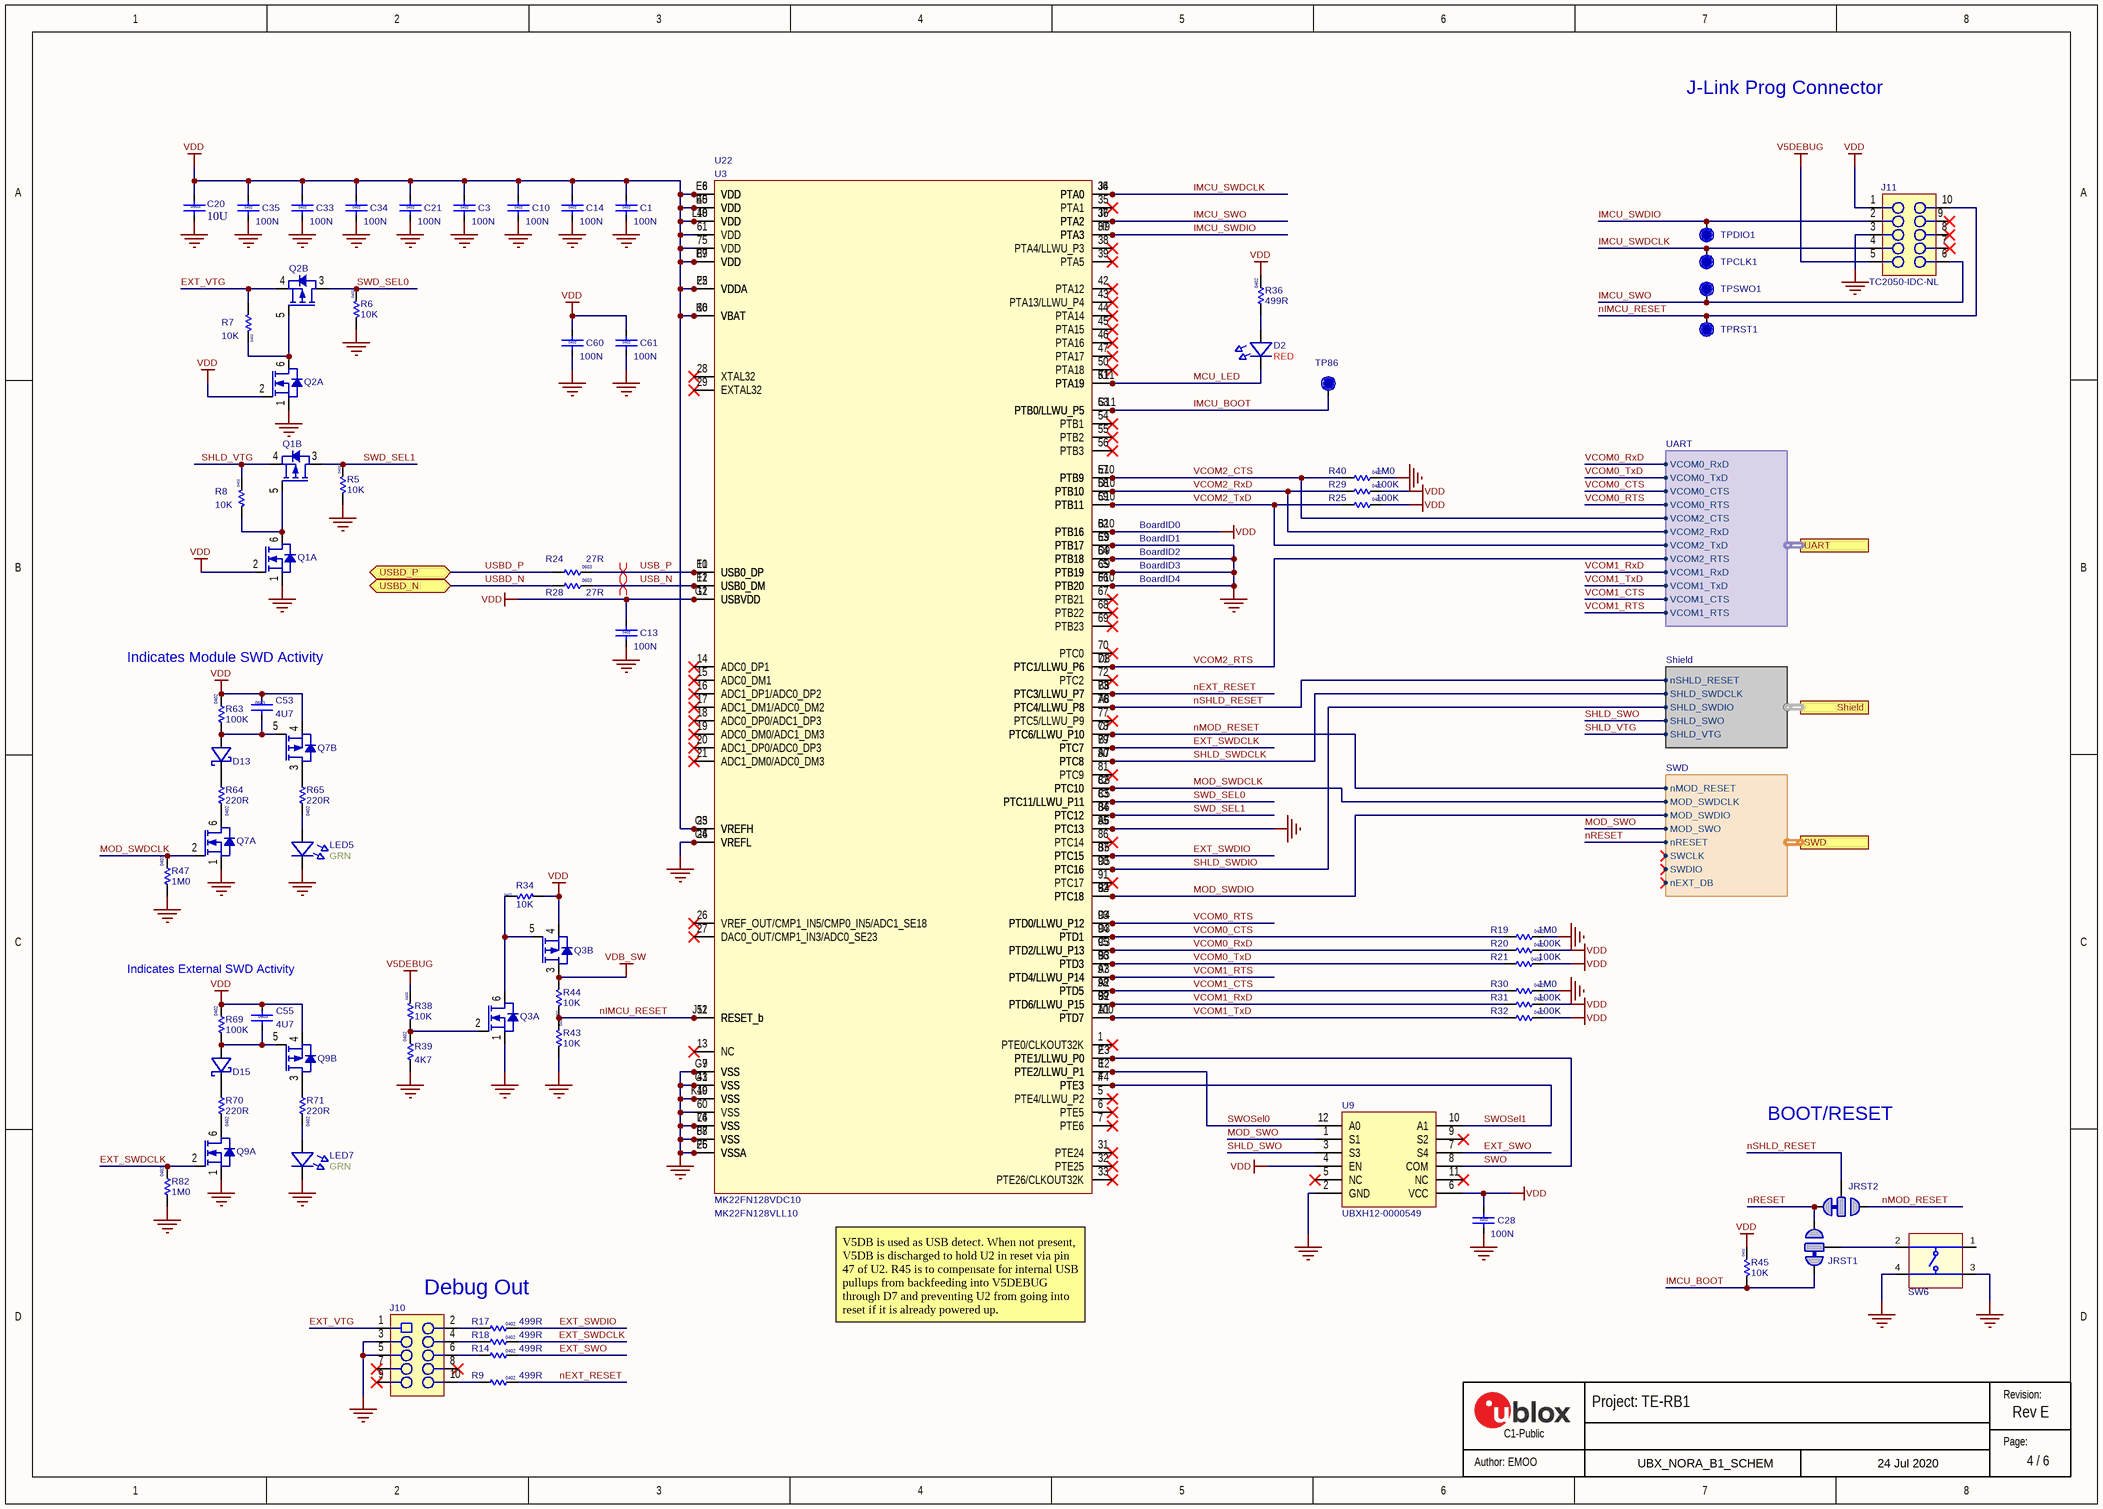
[diagram p2: UBX_NORA_B1_SCHEM_0004_Interface_MCU.SchDoc]

### Parts
C1  value 100N  Size: 0402  [Cap 0402 HD]
C3  value 100N  Size: 0402  [Cap 0402 HD]
C10  value 100N  Size: 0402  [Cap 0402 HD]
C13  value 100N  Size: 0402  [Cap 0402 HD]
C14  value 100N  Size: 0402  [Cap 0402 HD]
C20  value 10U  Size: 0603  [CAP 0603 HD]
C21  value 100N  Size: 0402  [Cap 0402 HD]
C28  value 100N  Size: 0402  [Cap 0402 HD]
C33  value 100N  Size: 0402  [Cap 0402 HD]
C34  value 100N  Size: 0402  [Cap 0402 HD]
C35  value 100N  Size: 0402  [Cap 0402 HD]
C53  value 4U7  Size: 0603  [CAP 0603 HD]
C55  value 4U7  Size: 0603  [CAP 0603 HD]
C60  value 100N  Size: 0402  [Cap 0402 HD]
C61  value 100N  Size: 0402  [Cap 0402 HD]
D2  Color: RED  [LED_0603_RED]
D13  (no value)  [SOD-523]
D15  (no value)  [SOD-523]
J10  (no value)  [FTSH-105-01-F-DV-K]
J11  (no value)  [TC2050-IDC-NL]
JRST1  (no value)  [Solderbridge-Option]  (net tie, no BOM)
JRST2  (no value)  [Solderbridge-Option]  (net tie, no BOM)
LED5  Color: GRN  [LED_0603_GREEN]
LED7  Color: GRN  [LED_0603_GREEN]
Q1  (no value)  [SOT-563]  (parts A,B of 2)
Q2  (no value)  [SOT-563]  (parts A,B of 2)
Q3  (no value)  [SOT-563]  (parts A,B of 2)
Q7  (no value)  [SOT-563]  (parts A,B of 2)
Q9  (no value)  [SOT-563]  (parts A,B of 2)
R5  value 10K  Size: 0402  [RES 0402 HD]
R6  value 10K  Size: 0402  [RES 0402 HD]
R7  value 10K  Size: 0402  [RES 0402 HD]
R8  value 10K  Size: 0402  [RES 0402 HD]
R9  value 499R  Size: 0402  [RES 0402 HD]
R14  value 499R  Size: 0402  [RES 0402 HD]
R17  value 499R  Size: 0402  [RES 0402 HD]
R18  value 499R  Size: 0402  [RES 0402 HD]
R19  value 1M0  Size: 0402  [RES 0402 HD]
R20  value 100K  Size: 0402  [RES 0402 HD]
R21  value 100K  Size: 0402  [RES 0402 HD]
R24  value 27R  Size: 0603  [RES 0603 HD]
R25  value 100K  Size: 0402  [RES 0402 HD]
R28  value 27R  Size: 0603  [RES 0603 HD]
R29  value 100K  Size: 0402  [RES 0402 HD]
R30  value 1M0  Size: 0402  [RES 0402 HD]
R31  value 100K  Size: 0402  [RES 0402 HD]
R32  value 100K  Size: 0402  [RES 0402 HD]
R34  value 10K  Size: 0402  [RES 0402 HD]
R36  value 499R  Size: 0402  [RES 0402 HD]
R38  value 10K  Size: 0402  [RES 0402 HD]
R39  value 4K7  Size: 0402  [RES 0402 HD]
R40  value 1M0  Size: 0402  [RES 0402 HD]
R43  value 10K  Size: 0402  [RES 0402 HD]
R44  value 10K  Size: 0402  [RES 0402 HD]
R45  value 10K  Size: 0402  [RES 0402 HD]
R47  value 1M0  Size: 0402  [RES 0402 HD]
R63  value 100K  Size: 0402  [RES 0402 HD]
R64  value 220R  Size: 0402  [RES 0402 HD]
R65  value 220R  Size: 0402  [RES 0402 HD]
R69  value 100K  Size: 0402  [RES 0402 HD]
R70  value 220R  Size: 0402  [RES 0402 HD]
R71  value 220R  Size: 0402  [RES 0402 HD]
R82  value 1M0  Size: 0402  [RES 0402 HD]
SW6  (no value)  [SW_TACT_SMT_6mm]
TP86  TP  [TP10R]  (value not drawn)  (no BOM)
TPCLK1  TP  [TP10R]  (value not drawn)  (no BOM)
TPDIO1  TP  [TP10R]  (value not drawn)  (no BOM)
TPRST1  TP  [TP10R]  (value not drawn)  (no BOM)
TPSWO1  TP  [TP10R]  (value not drawn)  (no BOM)
U3  MK22FN128VLL10  [TSQFP50P1600X1600X160-100N]
U9  UBXH12-0000549  [QFN-120.5P3x3-12pin]
U22  MK22FN128VDC10  [BGA0.5P8x8-121Pin]

### Ports
Shield (harness Shield), SWD (harness SWD), UART (harness UART), USBD_N (bidir), USBD_P (bidir)

### Harnesses
UART: VCOM2_TxD, VCOM2_RxD, VCOM2_RTS, VCOM2_CTS, VCOM1_RxD, VCOM1_TxD, VCOM1_CTS, VCOM1_RTS, VCOM0_RxD, VCOM0_TxD, VCOM0_CTS, VCOM0_RTS
SWD: MOD_SWDIO, MOD_SWDCLK, SWCLK, SWDIO, nMOD_RESET, MOD_SWO, nRESET, nEXT_DB
Shield: SHLD_VTG, SHLD_SWDIO, SHLD_SWDCLK, SHLD_SWO, nSHLD_RESET

### Nets
GND: C1.2 C3.2 C10.2 C13.2 C14.2 C20.2 C21.2 C28.2 C33.2 C34.2 C35.2 C60.2 C61.2 J10.3 J10.5 J11.3 LED5.1(C) LED7.1(C) Q1.1(S1) Q2.1(S1) Q3.1(S1) Q7.1(S1) Q9.1(S1) R5.1 R6.1 R19.2 R30.2 R39.1 R40.2 R43.1 R47.1 R82.1 SW6.3 SW6.4 U3.9(VSS) U3.24(VREFL) U3.25(VSSA) U3.41(VSS) U3.49(VSS) U3.60(VSS) U3.63(PTB17) U3.64(PTB18) U3.65(PTB19) U3.66(PTB20) U3.74(VSS) U3.85(PTC13) U3.88(VSS) U9.2(GND) U22.A6(PTC13) U22.C9(PTB19) U22.D9(PTB18) U22.E9(PTB17) U22.F6(VSSA) U22.F7(VSS) U22.F10(PTB20) U22.G3(VSS) U22.G6(VREFL) U22.G7(VSS) U22.K10(VSS) U22.L6(VSS)
V5DEBUG: J11.5 R38.2
VDB_SW: Q3.3(D2) R44.1
VDD: C1.1 C3.1 C10.1 C13.1 C14.1 C20.1 C21.1 C28.1 C33.1 C34.1 C35.1 C53.1 C55.1 C60.1 C61.1 J11.1 Q1.2(G1) Q2.2(G1) Q3.4(S2) Q7.4(S2) Q9.4(S2) R20.2 R21.2 R25.2 R29.2 R31.2 R32.2 R34.1 R36.2 R45.2 R63.2 R69.2 U3.8(VDD) U3.12(USBVDD) U3.22(VDDA) U3.23(VREFH) U3.30(VBAT) U3.40(VDD) U3.48(VDD) U3.61(VDD) U3.62(PTB16) U3.75(VDD) U3.89(VDD) U9.4(EN) U9.6(VCC) U22.B10(PTB16) U22.E5(VDD) U22.E6(VDD) U22.E7(VDD) U22.F5(VDDA) U22.G1(USBVDD) U22.G5(VREFH) U22.K6(VBAT) U22.L10(VDD)
EXT_SWDCLK: Q9.2(G1) R18.2 R82.2 U3.79(PTC7) U22.B7(PTC7)
EXT_SWDIO: R17.2 U3.87(PTC15) U22.B5(PTC15)
EXT_SWO: R14.2 U9.7(S4)
EXT_VTG: J10.1 Q2.4(S2) R7.1
IMCU_BOOT: JRST1.1 R45.1 TP86.1 U3.53(PTB0/LLWU_P5) U22.G11(PTB0/LLWU_P5)
IMCU_SWDCLK: J11.4 TPCLK1.1 U3.34(PTA0) U22.J6(PTA0)
IMCU_SWDIO: J11.2 TPDIO1.1 U3.37(PTA3) U22.H9(PTA3)
IMCU_SWO: J11.6 TPSWO1.1 U3.36(PTA2) U22.J7(PTA2)
MCU_LED: D2.1(C) U3.51(PTA19) U22.K11(PTA19)
MOD_SWDCLK: Q7.2(G1) R47.2 U3.82(PTC10) U22.C6(PTC10) ; port SWD.MOD_SWDCLK
MOD_SWDIO: U3.92(PTC18) U22.B4(PTC18) ; port SWD.MOD_SWDIO
MOD_SWO: U9.1(S1) ; port SWD.MOD_SWO
nEXT_RESET: R9.2 U3.73(PTC3/LLWU_P7) U22.B8(PTC3/LLWU_P7)
nIMCU_RESET: J11.10 R43.2 R44.2 TPRST1.1 U3.52(RESET_b) U22.J11(RESET_b)
nMOD_RESET: JRST2.3 U3.78(PTC6/LLWU_P10) U22.C7(PTC6/LLWU_P10) ; port SWD.nMOD_RESET
nRESET: JRST1.3 JRST2.1 ; port SWD.nRESET
nSHLD_RESET: JRST2.2 U3.76(PTC4/LLWU_P8) U22.A8(PTC4/LLWU_P8) ; port Shield.nSHLD_RESET
SHLD_SWDCLK: U3.80(PTC8) U22.A7(PTC8) ; port Shield.SHLD_SWDCLK
SHLD_SWDIO: U3.90(PTC16) U22.D5(PTC16) ; port Shield.SHLD_SWDIO
SHLD_SWO: U9.3(S3) ; port Shield.SHLD_SWO
SHLD_VTG: Q1.4(S2) R8.2 ; port Shield.SHLD_VTG
SWD_SEL0: Q2.3(D2) R6.2 U3.83(PTC11/LLWU_P11) U22.C5(PTC11/LLWU_P11)
SWD_SEL1: Q1.3(D2) R5.2 U3.84(PTC12) U22.B6(PTC12)
SWO: U3.2(PTE1/LLWU_P0) U9.8(COM) U22.E3(PTE1/LLWU_P0)
SWOSel0: U3.3(PTE2/LLWU_P1) U9.12(A0) U22.E2(PTE2/LLWU_P1)
SWOSel1: U3.4(PTE3) U9.10(A1) U22.F4(PTE3)
USB_N: R28.2 U3.11(USB0_DM) U22.F2(USB0_DM)
USB_P: R24.2 U3.10(USB0_DP) U22.F1(USB0_DP)
USBD_N: R28.1 ; port USBD_N
USBD_P: R24.1 ; port USBD_P
VCOM0_CTS: R19.1 U3.94(PTD1) U22.D3(PTD1) ; port UART.VCOM0_CTS
VCOM0_RTS: U3.93(PTD0/LLWU_P12) U22.D4(PTD0/LLWU_P12) ; port UART.VCOM0_RTS
VCOM0_RxD: R20.1 U3.95(PTD2/LLWU_P13) U22.C3(PTD2/LLWU_P13) ; port UART.VCOM0_RxD
VCOM0_TxD: R21.1 U3.96(PTD3) U22.B3(PTD3) ; port UART.VCOM0_TxD
VCOM1_CTS: R30.1 U3.98(PTD5) U22.A2(PTD5) ; port UART.VCOM1_CTS
VCOM1_RTS: U3.97(PTD4/LLWU_P14) U22.A3(PTD4/LLWU_P14) ; port UART.VCOM1_RTS
VCOM1_RxD: R31.1 U3.99(PTD6/LLWU_P15) U22.B2(PTD6/LLWU_P15) ; port UART.VCOM1_RxD
VCOM1_TxD: R32.1 U3.100(PTD7) U22.A1(PTD7) ; port UART.VCOM1_TxD
VCOM2_CTS: R40.1 U3.57(PTB9) U22.E10(PTB9) ; port UART.VCOM2_CTS
VCOM2_RTS: U3.71(PTC1/LLWU_P6) U22.D8(PTC1/LLWU_P6) ; port UART.VCOM2_RTS
VCOM2_RxD: R29.1 U3.58(PTB10) U22.D10(PTB10) ; port UART.VCOM2_RxD
VCOM2_TxD: R25.1 U3.59(PTB11) U22.C10(PTB11) ; port UART.VCOM2_TxD
NetC53_2: C53.2 D13.A(Anode) Q7.5(G2) R63.1
NetC55_2: C55.2 D15.A(Anode) Q9.5(G2) R69.1
NetD2_2: D2.2(A) R36.1
NetD13_C: D13.C(Cathode) R64.1
NetD15_C: D15.C(Cathode) R70.1
NetJ10_2: J10.2 R17.1
NetJ10_4: J10.4 R18.1
NetJ10_6: J10.6 R14.1
NetJ10_10: J10.10 R9.1
NetJRST1_2: JRST1.2 SW6.2
NetLED5_2: LED5.2(A) R65.2
NetLED7_2: LED7.2(A) R71.2
NetQ1_5: Q1.5(G2) Q1.6(D1) R8.1
NetQ2_5: Q2.5(G2) Q2.6(D1) R7.2
NetQ3_2: Q3.2(G1) R38.1 R39.2
NetQ3_5: Q3.5(G2) Q3.6(D1) R34.2
NetQ7_3: Q7.3(D2) R65.1
NetQ7_6: Q7.6(D1) R64.2
NetQ9_3: Q9.3(D2) R71.1
NetQ9_6: Q9.6(D1) R70.2

Not connected (* = marked no-connect by the designer): J10 7* 8* 9*; J11 7* 8* 9; SW6 1; U3 1(PTE0/CLKOUT32K)* 5(PTE4/LLWU_P2)* 6(PTE5)* 7(PTE6)* 13(NC)* 14(ADC0_DP1)* 15(ADC0_DM1)* 16(ADC1_DP1/ADC0_DP2)* 17(ADC1_DM1/ADC0_DM2)* 18(ADC0_DP0/ADC1_DP3)* 19(ADC0_DM0/ADC1_DM3)* 20(ADC1_DP0/ADC0_DP3)* 21(ADC1_DM0/ADC0_DM3)* 26(VREF_OUT/CMP1_IN5/CMP0_IN5/ADC1_SE18)* 27(DAC0_OUT/CMP1_IN3/ADC0_SE23)* 28(XTAL32)* 29(EXTAL32)* 31(PTE24)* 32(PTE25)* 33(PTE26/CLKOUT32K)* 35(PTA1)* 38(PTA4/LLWU_P3)* 39(PTA5)* 42(PTA12)* 43(PTA13/LLWU_P4)* 44(PTA14)* 45(PTA15)* 46(PTA16)* 47(PTA17)* 50(PTA18)* 54(PTB1)* 55(PTB2)* 56(PTB3)* 67(PTB21)* 68(PTB22)* 69(PTB23)* 70(PTC0)* 72(PTC2)* 77(PTC5/LLWU_P9)* 81(PTC9)* 86(PTC14)* 91(PTC17)*; U9 5(NC)* 9(S2)* 11(NC)*

### Layout directives
differential pair; net class USB_DIFF: USB_N, USB_P

### Notes on the sheet
- J-Link Prog Connector
- BoardID0
- BoardID1
- BoardID2
- BoardID3
- BoardID4
- Indicates Module SWD Activity
- Indicates External SWD Activity
- BOOT/RESET
- Debug Out
- V5DB is used as USB detect. When not present, V5DB is discharged to hold U2 in reset via pin 47 of U2. R45 is to compensate for internal USB pullups from backfeeding into V5DEBUG through D7 and preventing U2 from going into reset if it is already powered up.
- 24 Jul 2020
- Revision:
- Page:

### Library data of the parts
C1 C3 C10 C13 C14 C21 C28 C33-C35 C60 C61 = UBXH01-2021002: CAP CER X5R 0402 100N 10% 10V; Manufacturer: Murata Manufacturing Company, Ltd.; Manufacturer P/N: GRM155R61A104KA01; Editor: roland.rust; Env: GREEN; Permitted Use: Volume Products; Perferred: PREF; Mfg P/N Status: NRND; Mfg P/N Split: 100; Mfg P/N Released: Yes; Part Number: UBXH01-2021002; Tolerance: 10%; Max Voltage: 10V; Part Type: Capacitor; Released by: roland.rust; Release Data: 2005-07-22T13:59:44; UBX Wiki: https://wiki.u-blox.com/bin/view/Operations/PartDetails?index=5759; RefDes: C; Manufacturer 2: Samsung Electro-Mechanics; Manufacturer P/N 2: CL05A104KP5NNN; Mfg P/N Status 2: Active; Mfg P/N Split 2: 0; Mfg P/N Released 2: Yes; Mfg P/N Datasheet 2: https://wiki.u-blox.com/bin/view/Generic/Docs/DocumentSummary?index=28113
C20 = UBXH01-0000040: CAP CER X5R 0603 10U 20% 10V; Manufacturer: Taiyo Yuden Company, Ltd.; Manufacturer P/N: LMK107BBJ106MALT; Editor: pierpaolo.arban; Released by: matej.budin; Env: ROHS; Permitted Use: Volume Products; Perferred: PREF; Mfg P/N Status: Active; Mfg P/N Split: 100; Mfg P/N Released: Yes; Part Number: UBXH01-0000040; Tolerance: 20%; Max Voltage: 10V; Part Type: Capacitor; Release Data: 2013-01-10T11:54:39; UBX Wiki: https://wiki.u-blox.com/bin/view/Operations/PartDetails?index=16909; RefDes: C; Mfg P/N Datasheet: https://wiki.u-blox.com/bin/view/Generic/Docs/DocumentSummary?index=16905; Manufacturer 2: Murata Manufacturing Company, Ltd.; Manufacturer P/N 2: GRM188R61A106KAAL; Mfg P/N Status 2: Active; Mfg P/N Split 2: 0; Mfg P/N Released 2: Yes; Mfg P/N Datasheet 2: https://wiki.u-blox.com/bin/view/Generic/Docs/DocumentSummary?index=27232; Manufacturer 3: Taiyo Yuden Company, Ltd.; Manufacturer P/N 3: LMK107BJ106MALTD; Mfg P/N Status 3: NRND; Mfg P/N Split 3: 0; Mfg P/N Released 3: Yes; Mfg P/N Datasheet 3: https://wiki.u-blox.com/bin/view/Generic/Docs/DocumentSummary?index=29392
C53 C55 = UBXH01-2002003: as C15 on sheet UBX_NORA_B1_SCHEM_0001_NORA_B1_Module; Part Number: UBXH01-2002003; Tolerance: 10%; Max Voltage: 6.3V; Part Type: Capacitor; Release Data: 2016-02-02T16:39:45; UBX Wiki: https://wiki.u-blox.com/bin/view/Operations/PartDetails?index=5742; RefDes: C; Mfg P/N Datasheet: https://wiki.u-blox.com/bin/view/Generic/Docs/DocumentSummary?index=30154; Manufacturer 2: Murata Manufacturing Company, Ltd.; Manufacturer P/N 2: GRM188R61E475KE11; Mfg P/N Status 2: Active; Mfg P/N Split 2: 0; Mfg P/N Released 2: Yes; Mfg P/N Datasheet 2: https://wiki.u-blox.com/bin/view/Generic/Docs/DocumentSummary?index=30500; Manufacturer 3: Samsung Electro-Mechanics; Manufacturer P/N 3: CL10A475KO8NNN; Mfg P/N Status 3: NRND; Mfg P/N Split 3: 0; Mfg P/N Released 3: Yes; Mfg P/N Datasheet 3: https://wiki.u-blox.com/bin/view/Generic/Docs/DocumentSummary?index=28177
D2 = UBXH11-0000000: LED SMD 0603 ULTRABRIGHT LITE-ON LTST-C190KRKT RED 30mA; Manufacturer: Lite-on Technology Corporation; Editor: massimo.vlacci; Released by: sandro.sestan; Env: ROHS; Permitted Use: Support Products; Mfg P/N Status: Active; Mfg P/N Split: 100; Mfg P/N Released: Yes; Part Number: UBXH11-0000000; Value: RED; Max Current: 30mA; Size: 0603; Part Type: LED; Release Data: 2009-12-03T15:33:11; UBX Wiki: https://wiki.u-blox.com/bin/view/Operations/PartDetails?index=7900; Perferred: N/A; RefDes: DS; Manufacturer P/N: LTST-C190KRKT; Mfg P/N Datasheet: https://wiki.u-blox.com/bin/view/Generic/Docs/DocumentSummary?index=16221
D13 D15 = UBXH07-0000039: SCHOTTKY BARRIER DIODE 30V 200mA; Manufacturer: ON Semiconductor; Value: RB521S30T1G; Editor: matej.budin; Released by: pierpaolo.arban; Env: ROHS; Permitted Use: Volume Products; Perferred: PREF; Mfg P/N Status: Active; Mfg P/N Split: 100; Mfg P/N Released: Yes; Part Number: UBXH07-0000039; Max Voltage: 30V; Max Current: 200mA; Part Type: Diode; Release Data: 2015-06-18T10:04:48; UBX Wiki: https://wiki.u-blox.com/bin/view/Operations/PartDetails?index=22753; RefDes: D; Manufacturer P/N: RB521S30T1G; Mfg P/N Datasheet: https://wiki.u-blox.com/bin/view/Generic/Docs/DocumentSummary?index=22755
J10 = UBXH04-0000194: as J20 on sheet UBX_NORA_B1_SCHEM_0001_NORA_B1_Module; Part Number: UBXH04-0000194; Min Operating Temp: -40°C; Max Operating Temp: 85°C; Part Type: Connector; Release Data: 2015-11-06T11:35:39; UBX Wiki: https://wiki.u-blox.com/bin/view/Operations/PartDetails?index=20823; RefDes: J; Mfg P/N Datasheet: https://wiki.u-blox.com/bin/view/Generic/Docs/DocumentSummary?index=20824
J11 = UBXH00-0000101: TAG-CONNECT TC2050-IDC-NL 10-PIN PROBE PROGRAMMING HEADER NO LEGS TC2050-IDC-NL; Editor: eric.moog; Env: ROHS; Permitted Use: Support Products; Perferred: PREF; Mfg P/N Status: Active; Mfg P/N Split: 100; Manufacturer P/N: TC2050-IDC-NL; Part Number: UBXH00-0000101; Value: TC2050-IDC-NL; Min Operating Temp: -55°C; Max Operating Temp: 155°C; Part Type: Connector; UBX Wiki: https://wiki.u-blox.com/bin/view/Operations/PartDetails?index=38953; RefDes: J; Manufacturer: Tag-Connect; Mfg P/N Released: No; Mfg P/N Datasheet: https://wiki.u-blox.com/bin/view/Generic/Docs/DocumentSummary?index=38952
JRST1 JRST2 = UBXH00-0000083: as J16 on sheet UBX_NORA_B1_SCHEM_0001_NORA_B1_Module; Part Number: UBXH00-0000083; Min Operating Temp: -55°C; Max Operating Temp: 155°C; Part Type: Connector; UBX Wiki: https://wiki.u-blox.com/bin/view/Operations/PartDetails?index=36362; RefDes: J
LED5 LED7 = UBXH11-0000001: LED SMD 0603 GREEN 2.5V 20mA; Manufacturer: Kingbright; Manufacturer P/N: APT1608SGC; Editor: gianni.falleroni; Released by: alex.claville; Env: ROHS; Permitted Use: Support Products; Mfg P/N Status: Active; Mfg P/N Split: 50; Mfg P/N Released: Yes; Part Number: UBXH11-0000001; Value: GREEN; Max Voltage: 2.5V; Max Current: 20mA; Size: 0603; Part Type: LED; Release Data: 2022-09-27T14:26:54; UBX Wiki: https://wiki.u-blox.com/bin/view/Operations/PartDetails?index=7902; Perferred: N/A; RefDes: DS; Mfg P/N Datasheet: https://wiki.u-blox.com/bin/view/Generic/Docs/DocumentSummary?index=37527; Manufacturer 2: Lite-on Technology Corporation; Manufacturer P/N 2: LTST-C190KGKT; Mfg P/N Status 2: Active; Mfg P/N Split 2: 50; Mfg P/N Released 2: Yes; Mfg P/N Datasheet 2: https://wiki.u-blox.com/bin/view/Generic/Docs/DocumentSummary?index=16220
Q1-Q3 Q7 Q9 = UBXH20-0000084: as Q6 on sheet UBX_NORA_B1_SCHEM_0001_NORA_B1_Module; Part Number: UBXH20-0000084; Min Operating Temp: -55°C; Max Operating Temp: 155°C; Part Type: Transistor; Release Data: 2023-01-26T11:59:16; UBX Wiki: https://wiki.u-blox.com/bin/view/Operations/PartDetails?index=37717; RefDes: Q; Manufacturer P/N: NTZD3155CT1G; Mfg P/N Datasheet: https://wiki.u-blox.com/bin/view/Generic/Docs/DocumentSummary?index=9037
R5-R8 R34 R38 R43-R45 = UBXH18-0000065: as R59 on sheet UBX_NORA_B1_SCHEM_0001_NORA_B1_Module; Part Number: UBXH18-0000065; Tolerance: 1%; Max Power: 63mW; Part Type: Resistor; Release Data: 2012-06-08T18:02:21; UBX Wiki: https://wiki.u-blox.com/bin/view/Operations/PartDetails?index=16837; RefDes: R; Mfg P/N Datasheet: https://wiki.u-blox.com/bin/view/Generic/Docs/DocumentSummary?index=8222
R9 R14 R17 R18 R36 = UBXH18-0000269: RES THICK FILM CHIP 0402 499R 1% 100mW; Manufacturer: KOA; Manufacturer P/N: RK73H1ETTP4990F; Editor: pierpaolo.arban; Env: ROHS; Permitted Use: Volume Products; Perferred: PREF; Mfg P/N Status: Active; Mfg P/N Split: 100; Mfg P/N Released: No; Part Number: UBXH18-0000269; Tolerance: 1%; Max Power: 100mW; Min Operating Temp: -55°C; Max Operating Temp: 125°C; Part Type: Resistor; UBX Wiki: https://wiki.u-blox.com/bin/view/Operations/PartDetails?index=25384; RefDes: R; Mfg P/N Datasheet: https://wiki.u-blox.com/bin/view/Generic/Docs/DocumentSummary?index=8222
R19 R30 R40 R47 R82 = UBXH18-0008121: RES THICK FILM CHIP 0402 1M0 5% 63mW; Manufacturer: KOA; Manufacturer P/N: RK73B1ETTP105J; Editor: daniel.hurni; Released by: doris.zahnd; Env: ROHS; Permitted Use: Volume Products; Perferred: PREF; Mfg P/N Status: Active; Mfg P/N Split: 100; Mfg P/N Released: Yes; Part Number: UBXH18-0008121; Tolerance: 5%; Max Power: 63mW; Min Operating Temp: -55°C; Max Operating Temp: 125°C; Part Type: Resistor; Release Data: 2009-12-01T17:35:03; UBX Wiki: https://wiki.u-blox.com/bin/view/Operations/PartDetails?index=7052; RefDes: R; Mfg P/N Datasheet: https://wiki.u-blox.com/bin/view/Generic/Docs/DocumentSummary?index=4543
R20 R21 R25 R29 R31 R32 R63 R69 = UBXH18-0000005: RES THICK FILM CHIP 0402 100K 1% 63mW; Manufacturer: KOA; Manufacturer P/N: RK73H1ETTP1003F; Editor: dario.antonaz; Released by: sandro.sestan; Env: ROHS; Permitted Use: Volume Products; Mfg P/N Status: Active; Mfg P/N Split: 100; Mfg P/N Released: Yes; Part Number: UBXH18-0000005; Tolerance: 1%; Max Power: 63mW; Part Type: Resistor; Release Data: 2009-11-30T11:05:22; UBX Wiki: https://wiki.u-blox.com/bin/view/Operations/PartDetails?index=8114; Perferred: N/A; RefDes: R; Mfg P/N Datasheet: https://wiki.u-blox.com/bin/view/Generic/Docs/DocumentSummary?index=8222; Manufacturer 2: ROHM; Manufacturer P/N 2: MCR01MZPF1003; Mfg P/N Status 2: Active; Mfg P/N Split 2: 0; Mfg P/N Released 2: Yes; Mfg P/N Datasheet 2: https://wiki.u-blox.com/bin/view/Generic/Docs/DocumentSummary?index=8186
R24 R28 = UBXH18-0007035: RES THICK FILM CHIP 0603 27R 5% 100mW; Manufacturer: YAGEO; Manufacturer P/N: RC0603JR-0727RL; Editor: martin.frauchiger; Env: ROHS; Permitted Use: Volume Products; Perferred: PREF; Mfg P/N Status: Active; Mfg P/N Split: 100; Mfg P/N Released: Yes; Part Number: UBXH18-0007035; Tolerance: 5%; Max Power: 100mW; Part Type: Resistor; Released by: martin.frauchiger; Release Data: 2005-07-14T10:55:51; UBX Wiki: https://wiki.u-blox.com/bin/view/Operations/PartDetails?index=6657; RefDes: R
R39 = UBXH18-0000213: RES THICK FILM CHIP 0402 4K7 1% 63mW; Manufacturer: KOA; Manufacturer P/N: RK73H1ETTP4701F; Editor: michael.hein; Released by: vasyl.dykyy; Env: ROHS; Permitted Use: Volume Products; Perferred: PREF; Mfg P/N Status: Active; Mfg P/N Split: 100; Mfg P/N Released: Yes; Part Number: UBXH18-0000213; Tolerance: 1%; Max Power: 63mW; Part Type: Resistor; Release Data: 2015-10-02T11:47:33; Automotive: Yes; UBX Wiki: https://wiki.u-blox.com/bin/view/Operations/PartDetails?index=23300; RefDes: R; Mfg P/N Datasheet: https://wiki.u-blox.com/bin/view/Generic/Docs/DocumentSummary?index=8222
R64 R65 R70 R71 = UBXH18-0008033: RES THICK FILM CHIP 0402 220R 5% 100mW; Manufacturer: ROHM; Manufacturer P/N: MCR01MZPJ221; Editor: roland.rust; Env: ROHS; Permitted Use: Volume Products; Perferred: PREF; Mfg P/N Status: Active; Mfg P/N Split: 100; Mfg P/N Released: Yes; Part Number: UBXH18-0008033; Tolerance: 5%; Max Power: 100mW; Part Type: Resistor; Released by: roland.rust; Release Data: 2009-04-24T14:36:39; UBX Wiki: https://wiki.u-blox.com/bin/view/Operations/PartDetails?index=6914; RefDes: R; Manufacturer 2: KOA; Manufacturer P/N 2: RK73B1ETTP221J; Mfg P/N Status 2: Active; Mfg P/N Split 2: 0; Mfg P/N Released 2: Yes; Manufacturer 3: YAGEO; Manufacturer P/N 3: 2322_705_87221_L; Mfg P/N Status 3: NRND; Mfg P/N Split 3: 0; Mfg P/N Released 3: Yes
SW6 = UBXH19-0000035: TACTILE SWITCH SPST SINGLE SMD; Manufacturer P/N: PTS645SM43SMTR92LFS; Manufacturer: C&K; Value: PTS645SM43SMTR92LFS; Editor: enric.suchanek; Released by: charlotte.biber; Env: ROHS; Permitted Use: Internal Use; Perferred: PREF; Mfg P/N Status: Active; Mfg P/N Split: 100; Mfg P/N Released: No; Part Number: UBXH19-0000035; Min Operating Temp: -40°C; Max Operating Temp: 85°C; Part Type: Switch; Release Data: 2021-08-24T16:41:59; UBX Wiki: https://wiki.u-blox.com/bin/view/Operations/PartDetails?index=32051; RefDes: S; Mfg P/N Datasheet: https://wiki.u-blox.com/bin/view/Generic/Docs/DocumentSummary?index=32053
TP86 TPCLK1 TPDIO1 TPRST1 TPSWO1 = UBXH00-0000096: TESTPOINT 1MM CIRCULAR; Editor: eric.moog; Permitted Use: Volume Products; Perferred: PREF; Part Number: UBXH00-0000096; Min Operating Temp: -55°C; Max Operating Temp: 125°C; Part Type: Testpoint; UBX Wiki: https://wiki.u-blox.com/bin/view/Operations/PartDetails?index=38784; Env: N/A; RefDes: TP
U3 = UBXH05-0000157: MICROCONTROLLER IC 32-BIT 100MHZ 128KB (128K X 8) FLASH QFN; Manufacturer: NXP; Part number IPS: 00000001366; Artikkelnr Noca: N.A.; Editor: tobias.naumann; Released by: thai.nguyen-xuan; Env: ROHS; Permitted Use: Internal Use; Mfg P/N Status: Active; Mfg P/N Split: 100; Mfg P/N Released: No; Part Number: UBXH05-0000157; Manufacturer Part Number: MK22FN128VLL10; ComponentLink1URL: http://cache.freescale.com/files/microcontrollers/doc/data_sheet/K22P121M100SF9.pdf; ComponentLink1Description: Datasheet; ComponentLink2URL: https://cache.nxp.com/docs/en/package-information/98ASS23308W.pdf; ComponentLink2Description: Supplier link; HelpURL: *; Footprint Doc: LQFP-100; LatestRevisionDate: 2019-03-01; Pin Count: 100; Publisher: Nordic Semiconductor; Published: 2018-05-10; Value: MK22FN128VLL10; Note: *; Supplier 1: Digi-Key; Supplier Part Number 1: MK22FN128VLL10-ND; Supplier 2: Mouser; Supplier Part Number 2: 841-MK22FN128VLL10; Min Operating Temp: -40°C; Max Operating Temp: 105°C; Part Type: Digital/Mixed Signal ASIC; Release Data: 2022-01-03T08:47:21; UBX Wiki: https://wiki.u-blox.com/bin/view/Operations/PartDetails?index=36072; Perferred: N/A; RefDes: U; Manufacturer P/N: MK22FN128VLL10; Mfg P/N Datasheet: https://wiki.u-blox.com/bin/view/Generic/Docs/DocumentSummary?index=36069
U9 = UBXH12-0000549: ANALOG SWITCH SP4T 1 CIRCUIT 2.5OHM 12-QFN (3X3) 5.5V; Manufacturer: Vishay; Manufacturer P/N: DG2034EDN-T1-GE4; Manufacturer 1: Vishay Siliconix; Value: DG2034EDN-T1-GE4; Artikkelnr Noca: N.A.; Editor: eric.moog; Env: ROHS; Permitted Use: Support Products; Perferred: PREF; Mfg P/N Status: Active; Mfg P/N Split: 100; Mfg P/N Released: No; Part Number: UBXH12-0000549; ComponentLink1URL: http://www.vishay.com/docs/73172/dg2034e.pdf; ComponentLink1Description: Datasheet; ComponentLink2Description: Supplier link; Footprint Doc: 12-QFN; LatestRevisionDate: 2018-05-30; Pin Count: 12; Publisher: Nordic Semiconductor; Published: 2018-05-30; Note: *; Part number IPS: N.A.; Supplier 1: Digi-Key; Supplier Part Number 1: DG2034EDN-T1-GE4CT-ND; Supplier 2: Mouser; Supplier Part Number 2: 78-DG2034EDN-T1-GE4; Manufacturer Part Number 1: DG2034EDN-T1-GE4; Max Voltage: 5.5V; Min Operating Temp: -40°C; Max Operating Temp: 85°C; Part Type: Switch; UBX Wiki: https://wiki.u-blox.com/bin/view/Operations/PartDetails?index=38924; RefDes: U; Mfg P/N Datasheet: https://wiki.u-blox.com/bin/view/Generic/Docs/DocumentSummary?index=38923
U22 = UBXH05-0000174: MICROCONTROLLER IC 32-BIT 100MHZ 128KB (128K X 8) FLASH BGA_EVK-NORA-B1; Manufacturer: NXP; Item_Phase: Unreleased; Body Size: 8mm x 8mm; Component Mounting Type: SMT; Core Architecture: Cortex-M4F; Core Bits: 32 Bit; Max Oper Temp in C: 105; MFG Package: XFBGA-121; Min Oper Temp in C: -40; RAM Size: 24kB; SMT Pitch: 0.65mm; Use in new designs: Yes; Voltage: 3.6V; Editor: eric.moog; Env: ROHS; Permitted Use: Support Products; Perferred: PREF; Part Number: UBXH05-0000174; Manufacturer Part Number: MK22FN128VDC10; ComponentLink1URL: http://cache.freescale.com/files/microcontrollers/doc/data_sheet/K22P121M100SF9.pdf; ComponentLink1Description: Datasheet; ComponentLink2URL: https://cache.nxp.com/docs/en/package-information/98ASS23308W.pdf; ComponentLink2Description: Supplier link; HelpURL: *; Footprint Doc: XFBGA-121; Pin Count: 121; Value: MK22FN128VDC10; Note: *; Part Name: MK22FN128VDC10; Part_Type: Microcontroller; Revision: 00; Manufacturer P/N: MK22FN128VDC10; Flash Size: 128kB; Package Type: XFBGA; Pins: 100; Min Operating Temp: -40°C; Max Operating Temp: 105°C; Part Type: Digital/Mixed Signal ASIC; UBX Wiki: https://wiki.u-blox.com/bin/view/Operations/PartDetails?index=38965; RefDes: U